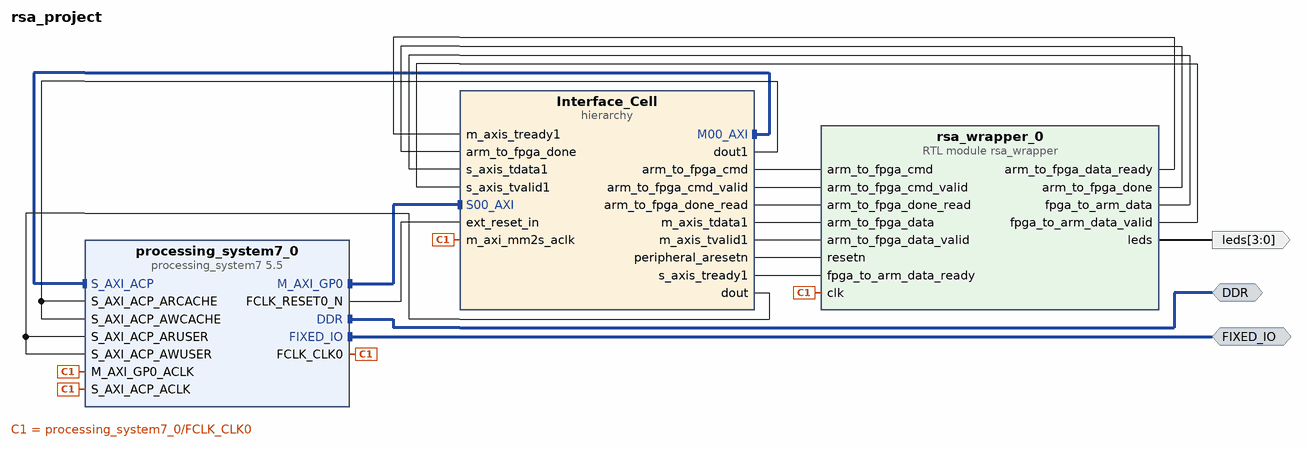
[diagram p0: block diagram of the top level]
# Vivado block design rsa_project, Vivado 2016.2
create_bd_design rsa_project

create_bd_intf_port -mode Master -vlnv xilinx.com:interface:ddrx_rtl:1.0 DDR
create_bd_intf_port -mode Master -vlnv xilinx.com:display_processing_system7:fixedio_rtl:1.0 FIXED_IO
create_bd_port -dir O -from 3 -to 0 leds

create_bd_cell -type hier Interface_Cell
create_bd_cell -type ip -vlnv xilinx.com:ip:processing_system7:5.5 processing_system7_0
set_property -dict [list \
  CONFIG.PCW_UIPARAM_DDR_FREQ_MHZ 525 \
  CONFIG.PCW_CRYSTAL_PERIPHERAL_FREQMHZ 50.000000 \
  CONFIG.PCW_APU_PERIPHERAL_FREQMHZ 100 \
  CONFIG.PCW_SDIO_PERIPHERAL_FREQMHZ 50 \
  CONFIG.PCW_FPGA0_PERIPHERAL_FREQMHZ 100 \
  CONFIG.PCW_FPGA1_PERIPHERAL_FREQMHZ 200 \
  CONFIG.PCW_USE_S_AXI_ACP 1 \
  CONFIG.PCW_PRESET_BANK1_VOLTAGE {LVCMOS 1.8V} \
  CONFIG.PCW_UIPARAM_DDR_PARTNO {MT41K128M16 JT-125} \
  CONFIG.PCW_QSPI_PERIPHERAL_ENABLE 1 \
  CONFIG.PCW_QSPI_GRP_SINGLE_SS_ENABLE 1 \
  CONFIG.PCW_QSPI_GRP_FBCLK_ENABLE 1 \
  CONFIG.PCW_ENET0_PERIPHERAL_ENABLE 1 \
  CONFIG.PCW_ENET0_ENET0_IO {MIO 16 .. 27} \
  CONFIG.PCW_ENET0_GRP_MDIO_ENABLE 1 \
  CONFIG.PCW_ENET0_RESET_ENABLE 0 \
  CONFIG.PCW_SD0_PERIPHERAL_ENABLE 1 \
  CONFIG.PCW_SD0_GRP_CD_ENABLE 1 \
  CONFIG.PCW_SD0_GRP_CD_IO {MIO 47} \
  CONFIG.PCW_SD0_GRP_WP_ENABLE 1 \
  CONFIG.PCW_UART1_PERIPHERAL_ENABLE 1 \
  CONFIG.PCW_TTC0_PERIPHERAL_ENABLE 1 \
  CONFIG.PCW_USB0_PERIPHERAL_ENABLE 1 \
  CONFIG.PCW_USB0_RESET_ENABLE 1 \
  CONFIG.PCW_USB0_RESET_IO {MIO 46} \
  CONFIG.PCW_GPIO_MIO_GPIO_ENABLE 1 \
] [get_bd_cells processing_system7_0]
# 110 more settings of processing_system7_0 are not shown: defaults, MIO pin electricals, DDR timing, and values the tool derives
create_bd_cell -type module -reference rsa_wrapper rsa_wrapper_0

# ---- hierarchy /Interface_Cell ----
current_bd_instance /Interface_Cell
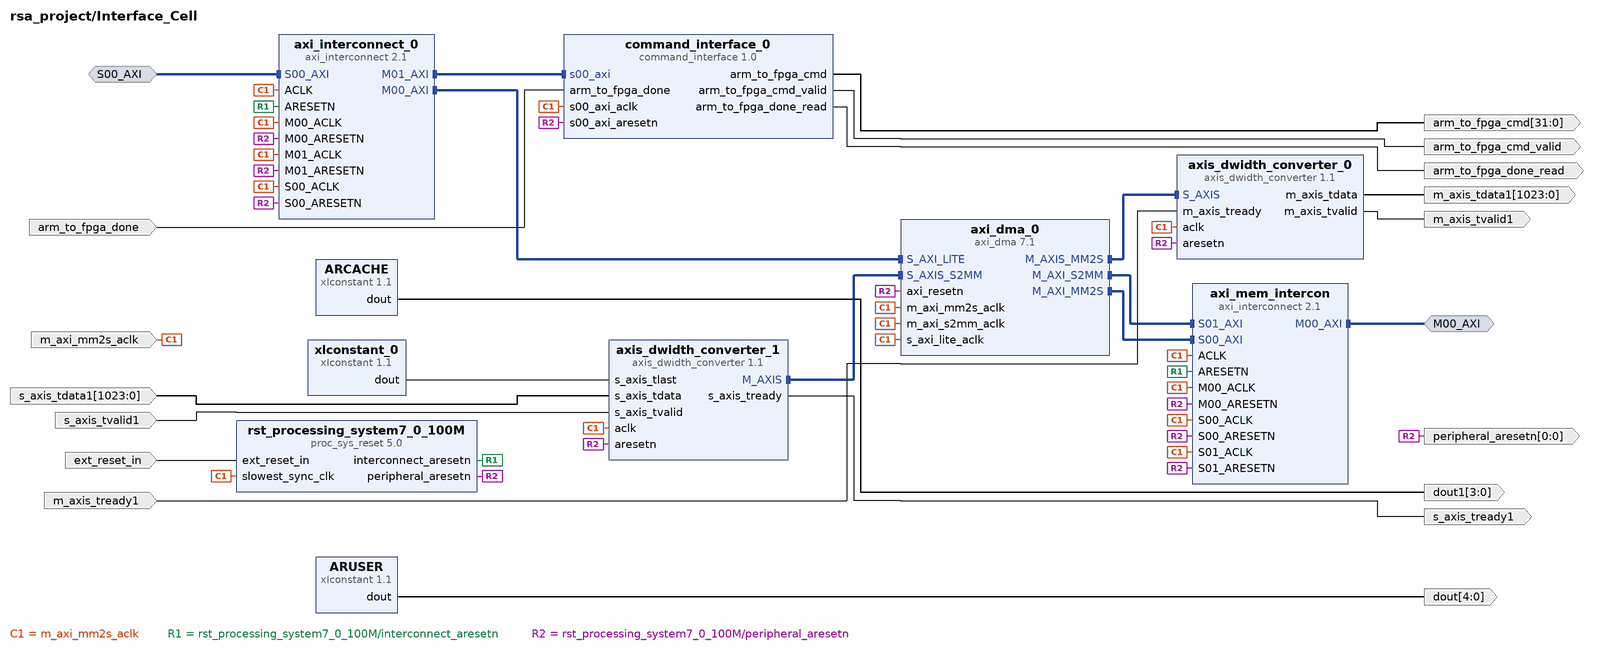
[diagram p1: block diagram inside /Interface_Cell]
create_bd_intf_pin -mode Master -vlnv xilinx.com:interface:aximm_rtl:1.0 M00_AXI
create_bd_intf_pin -mode Slave -vlnv xilinx.com:interface:aximm_rtl:1.0 S00_AXI
create_bd_pin -dir O -from 31 -to 0 arm_to_fpga_cmd
create_bd_pin -dir O arm_to_fpga_cmd_valid
create_bd_pin -dir I arm_to_fpga_done
create_bd_pin -dir O arm_to_fpga_done_read
create_bd_pin -dir O -from 4 -to 0 dout
create_bd_pin -dir O -from 3 -to 0 dout1
create_bd_pin -dir I -type rst ext_reset_in
create_bd_pin -dir I -type clk m_axi_mm2s_aclk
create_bd_pin -dir O -from 1023 -to 0 m_axis_tdata1
create_bd_pin -dir I m_axis_tready1
create_bd_pin -dir O m_axis_tvalid1
create_bd_pin -dir O -from 0 -to 0 -type rst peripheral_aresetn
create_bd_pin -dir I -from 1023 -to 0 s_axis_tdata1
create_bd_pin -dir O s_axis_tready1
create_bd_pin -dir I s_axis_tvalid1

create_bd_cell -type ip -vlnv xilinx.com:ip:xlconstant:1.1 ARCACHE
set_property -dict {CONFIG.CONST_WIDTH 4 CONFIG.CONST_VAL 2} [get_bd_cells ARCACHE]
create_bd_cell -type ip -vlnv xilinx.com:ip:xlconstant:1.1 ARUSER
set_property -dict {CONFIG.CONST_WIDTH 5} [get_bd_cells ARUSER]
create_bd_cell -type ip -vlnv xilinx.com:ip:axi_dma:7.1 axi_dma_0
set_property -dict [list \
  CONFIG.c_include_sg 0 \
  CONFIG.c_sg_length_width 8 \
  CONFIG.c_micro_dma 1 \
  CONFIG.c_m_axi_mm2s_data_width 32 \
  CONFIG.c_m_axis_mm2s_tdata_width 32 \
  CONFIG.c_mm2s_burst_size 32 \
  CONFIG.c_include_s2mm 1 \
  CONFIG.c_m_axi_s2mm_data_width 32 \
  CONFIG.c_s2mm_burst_size 32 \
] [get_bd_cells axi_dma_0]
create_bd_cell -type ip -vlnv xilinx.com:ip:axi_interconnect:2.1 axi_interconnect_0
set_property -dict {CONFIG.NUM_MI 2 CONFIG.STRATEGY 1 CONFIG.ENABLE_ADVANCED_OPTIONS 1} [get_bd_cells axi_interconnect_0]
create_bd_cell -type ip -vlnv xilinx.com:ip:axi_interconnect:2.1 axi_mem_intercon
set_property -dict [list \
  CONFIG.NUM_SI 2 \
  CONFIG.NUM_MI 1 \
  CONFIG.STRATEGY 1 \
  CONFIG.ENABLE_ADVANCED_OPTIONS 1 \
  CONFIG.S00_HAS_DATA_FIFO 0 \
  CONFIG.S01_HAS_DATA_FIFO 0 \
] [get_bd_cells axi_mem_intercon]
create_bd_cell -type ip -vlnv xilinx.com:ip:axis_dwidth_converter:1.1 axis_dwidth_converter_0
set_property -dict [list \
  CONFIG.S_TDATA_NUM_BYTES 4 \
  CONFIG.M_TDATA_NUM_BYTES 128 \
  CONFIG.TID_WIDTH 0 \
  CONFIG.TDEST_WIDTH 0 \
  CONFIG.TUSER_BITS_PER_BYTE 0 \
  CONFIG.HAS_TLAST 0 \
  CONFIG.HAS_TSTRB 0 \
  CONFIG.HAS_TKEEP 0 \
  CONFIG.HAS_MI_TKEEP 0 \
] [get_bd_cells axis_dwidth_converter_0]
create_bd_cell -type ip -vlnv xilinx.com:ip:axis_dwidth_converter:1.1 axis_dwidth_converter_1
set_property -dict [list \
  CONFIG.S_TDATA_NUM_BYTES 128 \
  CONFIG.M_TDATA_NUM_BYTES 4 \
  CONFIG.TID_WIDTH 0 \
  CONFIG.TDEST_WIDTH 0 \
  CONFIG.TUSER_BITS_PER_BYTE 0 \
  CONFIG.HAS_TLAST 1 \
  CONFIG.HAS_TSTRB 0 \
  CONFIG.HAS_TKEEP 0 \
] [get_bd_cells axis_dwidth_converter_1]
create_bd_cell -type ip -vlnv cosic:fturan:command_interface:1.0 command_interface_0
create_bd_cell -type ip -vlnv xilinx.com:ip:proc_sys_reset:5.0 rst_processing_system7_0_100M
create_bd_cell -type ip -vlnv xilinx.com:ip:xlconstant:1.1 xlconstant_0

# ---- connections ----

current_bd_instance /Interface_Cell
connect_bd_intf_net [get_bd_intf_pins axi_dma_0/M_AXI_S2MM] [get_bd_intf_pins axi_mem_intercon/S01_AXI]
connect_bd_intf_net [get_bd_intf_pins axi_dma_0/M_AXIS_MM2S] [get_bd_intf_pins axis_dwidth_converter_0/S_AXIS]
connect_bd_intf_net [get_bd_intf_pins axi_dma_0/M_AXI_MM2S] [get_bd_intf_pins axi_mem_intercon/S00_AXI]
connect_bd_intf_net [get_bd_intf_pins axi_dma_0/S_AXI_LITE] [get_bd_intf_pins axi_interconnect_0/M00_AXI]
connect_bd_intf_net [get_bd_intf_pins axi_interconnect_0/M01_AXI] [get_bd_intf_pins command_interface_0/s00_axi]
connect_bd_intf_net [get_bd_intf_pins axi_dma_0/S_AXIS_S2MM] [get_bd_intf_pins axis_dwidth_converter_1/M_AXIS]
connect_bd_intf_net [get_bd_intf_pins M00_AXI] [get_bd_intf_pins axi_mem_intercon/M00_AXI]
connect_bd_intf_net [get_bd_intf_pins S00_AXI] [get_bd_intf_pins axi_interconnect_0/S00_AXI]
connect_bd_net [get_bd_pins ARCACHE/dout] [get_bd_pins dout1]
connect_bd_net [get_bd_pins ARUSER/dout] [get_bd_pins dout]
connect_bd_net [get_bd_pins arm_to_fpga_done] [get_bd_pins command_interface_0/arm_to_fpga_done]
connect_bd_net [get_bd_pins axis_dwidth_converter_0/m_axis_tdata] [get_bd_pins m_axis_tdata1]
connect_bd_net [get_bd_pins axis_dwidth_converter_0/m_axis_tvalid] [get_bd_pins m_axis_tvalid1]
connect_bd_net [get_bd_pins axis_dwidth_converter_1/s_axis_tready] [get_bd_pins s_axis_tready1]
connect_bd_net [get_bd_pins command_interface_0/arm_to_fpga_cmd] [get_bd_pins arm_to_fpga_cmd]
connect_bd_net [get_bd_pins command_interface_0/arm_to_fpga_cmd_valid] [get_bd_pins arm_to_fpga_cmd_valid]
connect_bd_net [get_bd_pins command_interface_0/arm_to_fpga_done_read] [get_bd_pins arm_to_fpga_done_read]
connect_bd_net [get_bd_pins ext_reset_in] [get_bd_pins rst_processing_system7_0_100M/ext_reset_in]
connect_bd_net [get_bd_pins m_axi_mm2s_aclk] \
  [get_bd_pins axi_dma_0/m_axi_mm2s_aclk] [get_bd_pins axi_dma_0/m_axi_s2mm_aclk] [get_bd_pins axi_dma_0/s_axi_lite_aclk] \
  [get_bd_pins axis_dwidth_converter_0/aclk] [get_bd_pins axis_dwidth_converter_1/aclk] \
  [get_bd_pins command_interface_0/s00_axi_aclk] [get_bd_pins rst_processing_system7_0_100M/slowest_sync_clk] \
  [get_bd_pins axi_interconnect_0/ACLK] [get_bd_pins axi_interconnect_0/M00_ACLK] [get_bd_pins axi_interconnect_0/M01_ACLK] \
  [get_bd_pins axi_interconnect_0/S00_ACLK] [get_bd_pins axi_mem_intercon/ACLK] [get_bd_pins axi_mem_intercon/M00_ACLK] \
  [get_bd_pins axi_mem_intercon/S00_ACLK] [get_bd_pins axi_mem_intercon/S01_ACLK]
connect_bd_net -net m_axis_tready1_1 [get_bd_pins m_axis_tready1] [get_bd_pins axis_dwidth_converter_0/m_axis_tready]
connect_bd_net [get_bd_pins rst_processing_system7_0_100M/interconnect_aresetn] \
  [get_bd_pins axi_interconnect_0/ARESETN] [get_bd_pins axi_mem_intercon/ARESETN]
connect_bd_net [get_bd_pins rst_processing_system7_0_100M/peripheral_aresetn] \
  [get_bd_pins peripheral_aresetn] [get_bd_pins axi_dma_0/axi_resetn] [get_bd_pins axis_dwidth_converter_0/aresetn] \
  [get_bd_pins axis_dwidth_converter_1/aresetn] [get_bd_pins command_interface_0/s00_axi_aresetn] \
  [get_bd_pins axi_interconnect_0/M00_ARESETN] [get_bd_pins axi_interconnect_0/M01_ARESETN] \
  [get_bd_pins axi_interconnect_0/S00_ARESETN] [get_bd_pins axi_mem_intercon/M00_ARESETN] \
  [get_bd_pins axi_mem_intercon/S00_ARESETN] [get_bd_pins axi_mem_intercon/S01_ARESETN]
connect_bd_net -net s_axis_tdata1_1 [get_bd_pins s_axis_tdata1] [get_bd_pins axis_dwidth_converter_1/s_axis_tdata]
connect_bd_net -net s_axis_tvalid1_1 [get_bd_pins s_axis_tvalid1] [get_bd_pins axis_dwidth_converter_1/s_axis_tvalid]
connect_bd_net [get_bd_pins xlconstant_0/dout] [get_bd_pins axis_dwidth_converter_1/s_axis_tlast]

current_bd_instance /
connect_bd_intf_net [get_bd_intf_pins Interface_Cell/M00_AXI] [get_bd_intf_pins processing_system7_0/S_AXI_ACP]
connect_bd_intf_net [get_bd_intf_pins Interface_Cell/S00_AXI] [get_bd_intf_pins processing_system7_0/M_AXI_GP0]
connect_bd_intf_net [get_bd_intf_ports DDR] [get_bd_intf_pins processing_system7_0/DDR]
connect_bd_intf_net [get_bd_intf_ports FIXED_IO] [get_bd_intf_pins processing_system7_0/FIXED_IO]
connect_bd_net -net ARCACHE_dout [get_bd_pins Interface_Cell/dout1] \
  [get_bd_pins processing_system7_0/S_AXI_ACP_ARCACHE] [get_bd_pins processing_system7_0/S_AXI_ACP_AWCACHE]
connect_bd_net [get_bd_pins Interface_Cell/arm_to_fpga_cmd] [get_bd_pins rsa_wrapper_0/arm_to_fpga_cmd]
connect_bd_net [get_bd_pins Interface_Cell/arm_to_fpga_cmd_valid] [get_bd_pins rsa_wrapper_0/arm_to_fpga_cmd_valid]
connect_bd_net [get_bd_pins Interface_Cell/arm_to_fpga_done_read] [get_bd_pins rsa_wrapper_0/arm_to_fpga_done_read]
connect_bd_net [get_bd_pins Interface_Cell/m_axis_tdata1] [get_bd_pins rsa_wrapper_0/arm_to_fpga_data]
connect_bd_net [get_bd_pins Interface_Cell/m_axis_tvalid1] [get_bd_pins rsa_wrapper_0/arm_to_fpga_data_valid]
connect_bd_net [get_bd_pins Interface_Cell/peripheral_aresetn] [get_bd_pins rsa_wrapper_0/resetn]
connect_bd_net [get_bd_pins Interface_Cell/s_axis_tready1] [get_bd_pins rsa_wrapper_0/fpga_to_arm_data_ready]
connect_bd_net -net m_axis_tready1_1 [get_bd_pins rsa_wrapper_0/arm_to_fpga_data_ready] [get_bd_pins Interface_Cell/m_axis_tready1]
connect_bd_net [get_bd_pins processing_system7_0/FCLK_CLK0] \
  [get_bd_pins processing_system7_0/M_AXI_GP0_ACLK] [get_bd_pins processing_system7_0/S_AXI_ACP_ACLK] \
  [get_bd_pins Interface_Cell/m_axi_mm2s_aclk] [get_bd_pins rsa_wrapper_0/clk]
connect_bd_net [get_bd_pins processing_system7_0/FCLK_RESET0_N] [get_bd_pins Interface_Cell/ext_reset_in]
connect_bd_net [get_bd_pins rsa_wrapper_0/arm_to_fpga_done] [get_bd_pins Interface_Cell/arm_to_fpga_done]
connect_bd_net [get_bd_pins rsa_wrapper_0/leds] [get_bd_ports leds]
connect_bd_net -net s_axis_tdata1_1 [get_bd_pins rsa_wrapper_0/fpga_to_arm_data] [get_bd_pins Interface_Cell/s_axis_tdata1]
connect_bd_net -net s_axis_tvalid1_1 [get_bd_pins rsa_wrapper_0/fpga_to_arm_data_valid] [get_bd_pins Interface_Cell/s_axis_tvalid1]
connect_bd_net -net xlconstant_1_dout [get_bd_pins Interface_Cell/dout] \
  [get_bd_pins processing_system7_0/S_AXI_ACP_ARUSER] [get_bd_pins processing_system7_0/S_AXI_ACP_AWUSER]

# ---- address map ----
assign_bd_address -offset 0x00000000 -range 512M -target_address_space [get_bd_addr_spaces Interface_Cell/axi_dma_0/Data_MM2S] [get_bd_addr_segs processing_system7_0/S_AXI_ACP/ACP_DDR_LOWOCM]
assign_bd_address -offset 0xFC000000 -range 16M -target_address_space [get_bd_addr_spaces Interface_Cell/axi_dma_0/Data_MM2S] [get_bd_addr_segs processing_system7_0/S_AXI_ACP/ACP_QSPI_LINEAR]
exclude_bd_addr_seg -offset 0x40000000 -range 1G -target_address_space [get_bd_addr_spaces Interface_Cell/axi_dma_0/Data_MM2S] [get_bd_addr_segs processing_system7_0/S_AXI_ACP/ACP_M_AXI_GP0]
exclude_bd_addr_seg -offset 0xE0000000 -range 4M -target_address_space [get_bd_addr_spaces Interface_Cell/axi_dma_0/Data_MM2S] [get_bd_addr_segs processing_system7_0/S_AXI_ACP/ACP_IOP]
assign_bd_address -offset 0x00000000 -range 512M -target_address_space [get_bd_addr_spaces Interface_Cell/axi_dma_0/Data_S2MM] [get_bd_addr_segs processing_system7_0/S_AXI_ACP/ACP_DDR_LOWOCM]
assign_bd_address -offset 0xFC000000 -range 16M -target_address_space [get_bd_addr_spaces Interface_Cell/axi_dma_0/Data_S2MM] [get_bd_addr_segs processing_system7_0/S_AXI_ACP/ACP_QSPI_LINEAR]
exclude_bd_addr_seg -offset 0x40000000 -range 1G -target_address_space [get_bd_addr_spaces Interface_Cell/axi_dma_0/Data_S2MM] [get_bd_addr_segs processing_system7_0/S_AXI_ACP/ACP_M_AXI_GP0]
exclude_bd_addr_seg -offset 0xE0000000 -range 4M -target_address_space [get_bd_addr_spaces Interface_Cell/axi_dma_0/Data_S2MM] [get_bd_addr_segs processing_system7_0/S_AXI_ACP/ACP_IOP]
assign_bd_address -offset 0x40400000 -range 64K -target_address_space [get_bd_addr_spaces processing_system7_0/Data] [get_bd_addr_segs Interface_Cell/axi_dma_0/S_AXI_LITE/Reg]
assign_bd_address -offset 0x43C00000 -range 64K -target_address_space [get_bd_addr_spaces processing_system7_0/Data] [get_bd_addr_segs Interface_Cell/command_interface_0/s00_axi/axi_lite]

validate_bd_design
save_bd_design
